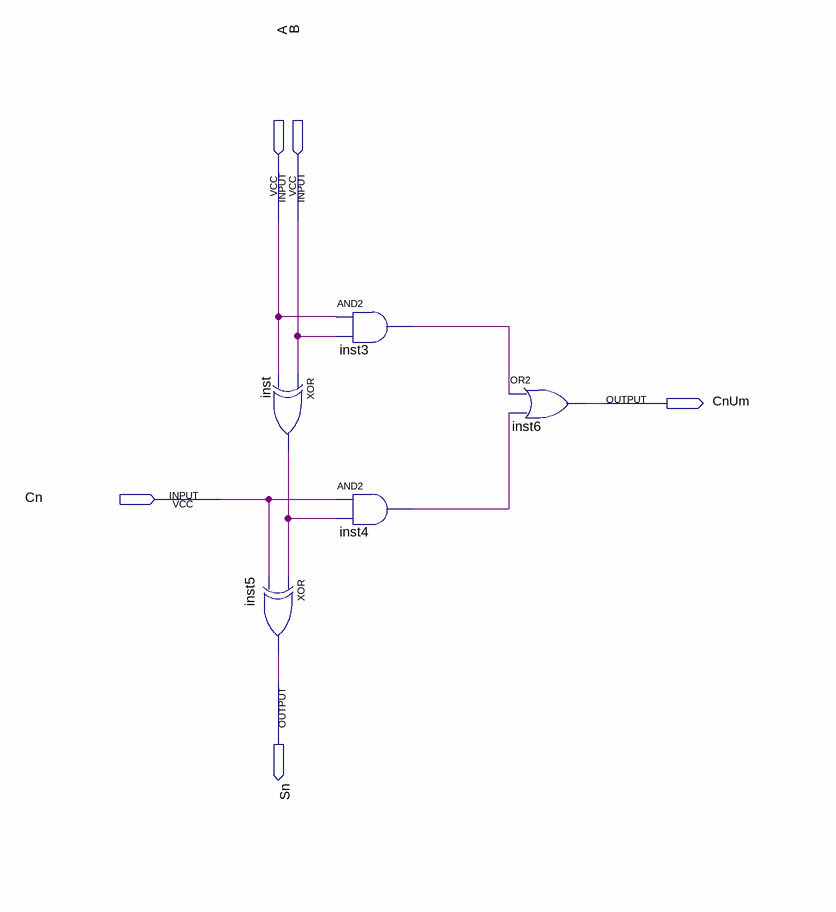
[diagram p0: schematic sheet]
// Quartus schematic SomadorBitOK.bdf as structural Verilog: 5 symbols, 5 pins
module SomadorBitOK (
  input  A,
  input  B,
  input  Cn,
  output CnUm,
  output Sn
);

  wire inst3_out, inst4_out, inst_out;

  xor inst (inst_out, B, A);
  xor inst5 (Sn, inst_out, Cn);
  and inst3 (inst3_out, A, B);
  and inst4 (inst4_out, Cn, inst_out);
  or inst6 (CnUm, inst3_out, inst4_out);
endmodule
